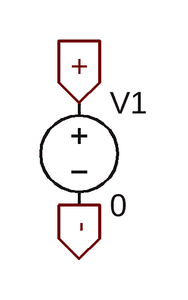
[diagram p0: schematic jumperg.asc]
jumperg.asc, the LTspice schematic file:
Version 4
SHEET 1 880 680
FLAG 240 112 +
IOPIN 240 112 In
FLAG 240 192 -
IOPIN 240 192 Out
SYMBOL voltage 240 96 R0
SYMATTR InstName V1
SYMATTR Value 0

The netlist it stands for:
* jumperg.asc
V1 + - 0
.backanno
.end